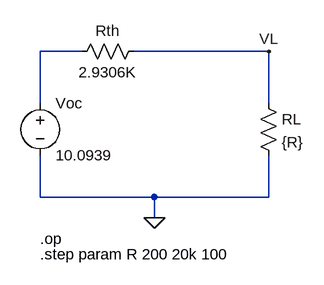
[diagram p0: schematic maxpow.asc]
maxpow.asc, the LTspice schematic file:
Version 4
SHEET 1 1080 680
WIRE 272 48 208 48
WIRE 560 48 352 48
WIRE 208 128 208 48
WIRE 560 128 560 48
WIRE 208 272 208 208
WIRE 384 272 208 272
WIRE 560 272 560 208
WIRE 560 272 384 272
WIRE 384 304 384 272
FLAG 384 304 0
FLAG 560 48 VL
SYMBOL voltage 208 112 R0
SYMATTR InstName Voc
SYMATTR Value 10.0939
SYMBOL res 368 32 R90
WINDOW 0 0 56 VBottom 2
WINDOW 3 32 56 VTop 2
SYMATTR InstName Rth
SYMATTR Value 2.9306K
SYMBOL res 544 112 R0
SYMATTR InstName RL
SYMATTR Value {R}
TEXT 208 360 Left 2 !.step param R 200 20k 100
TEXT 208 336 Left 2 !.op

The netlist it stands for:
* maxpow.asc
Voc N001 0 10.0939
Rth VL N001 2.9306K
RL VL 0 {R}
.step param R 200 20k 100
.op
.backanno
.end

* Results of the author's LTspice run, read from the files saved beside the schematic
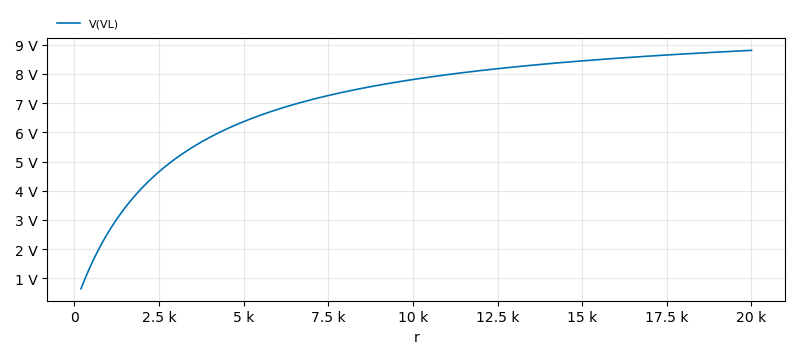
[diagram p1: Operating Point of maxpow.asc, plotted from the saved traces]
* Operating Point, 1 run:
*   V(VL): 644.9 mV at r=200 , 8.804 V at r=20 k, min 644.9 mV, max 8.804 V